# EAGLE design TempHumiditySensorBoard (EAGLE 8.5.0)
MODDATE: 2015-12-09; MODINIT: JQI
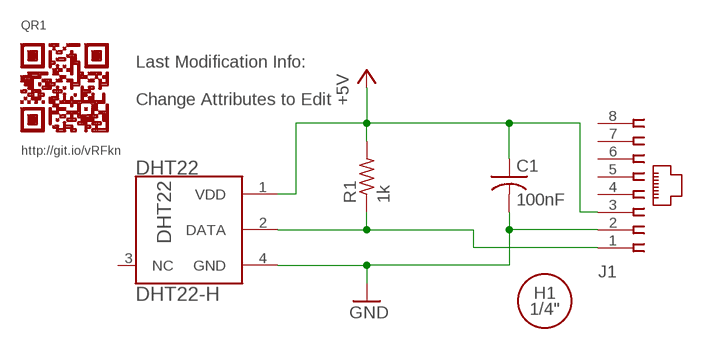
[diagram p0: schematic, sheet 1]

## Parts
C1  100nF  C-USC1206  [C1206]
DHT22  DHT22-H  [DHT22-H]
H1  MOUNT-HOLE-1/4"-FREE  [MOUNT-HOLE-1/4"-FREE]
J1  555164-1  [555164-1]
QR1  QR-HTTP://GIT.IO/VRFKN  [QR-HTTP://GIT.IO/VRFKN]
R1  1k  R-US_R1206  [R1206]
U$2  INFOROW  [INIT_DATE_LINE]

## Nets
+5V: C1.1 DHT22.1(VDD) J1.3 R1.2
DATA: DHT22.2(DATA) J1.1 R1.1
GND: C1.2 DHT22.4(GND) J1.2
Unconnected: DHT22.3(NC) J1.4 J1.5 J1.6 J1.7 J1.8

## Library data of the parts
C1 = resistor:C-US: CAPACITOR, American symbol; PARTNO: CL31B104JBCNNNC
DHT22 = dht22:DHT22; PARTNO: 385
H1 = JQI-holes:MOUNT-HOLE; HOLE-FIT: Free; HOLE-SIZE: 1/4"
J1 = con-amp:555164-1: AMP connector; PARTNO: 555164-1
QR1 = QR-git.io-vRFkn:QR-HTTP://GIT.IO/VRFKN: QR Code pointing to http://git.io/vRFkn; QR_DEST: http://git.io/vRFkn
R1 = resistor:R-US_: RESISTOR, American symbol; PARTNO: ERJ-8ENF2001V
U$2 = info:INFO; MODAUTH: ZSS; MODDATE: 2015-12-09

## Net classes
0 default: width 0.254 mm

## Board
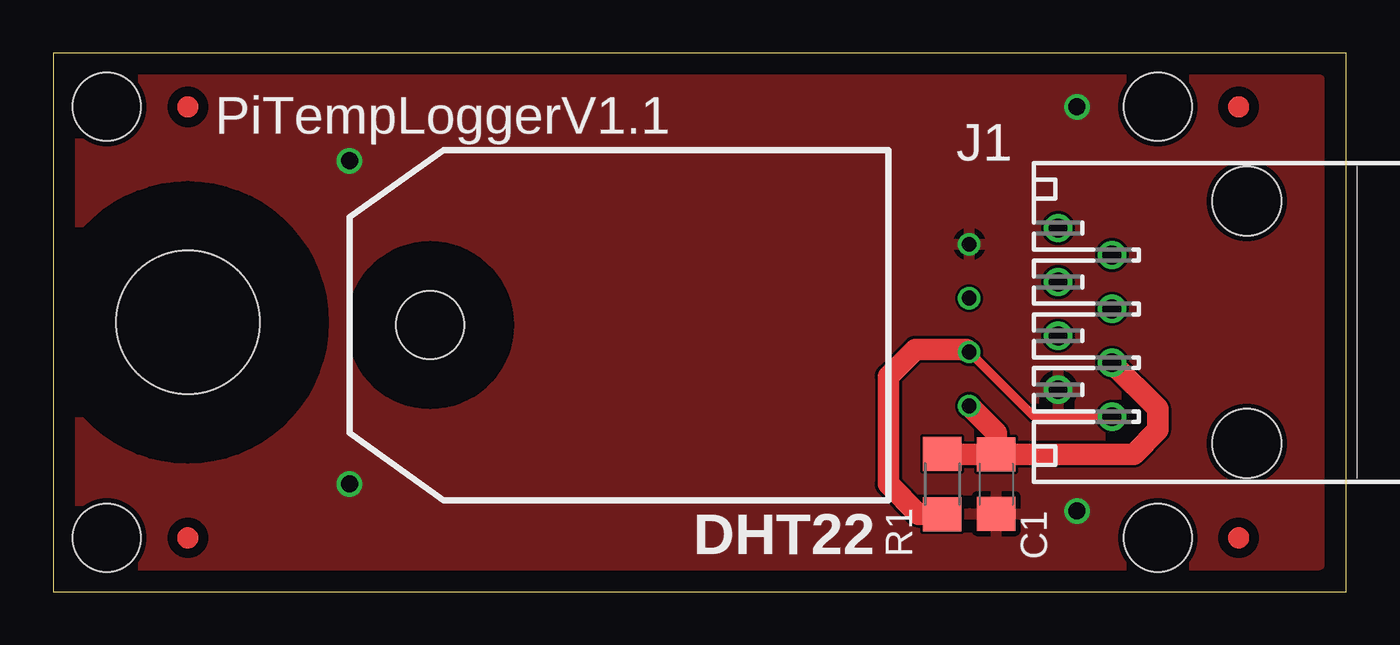
[diagram p1: board, top side]
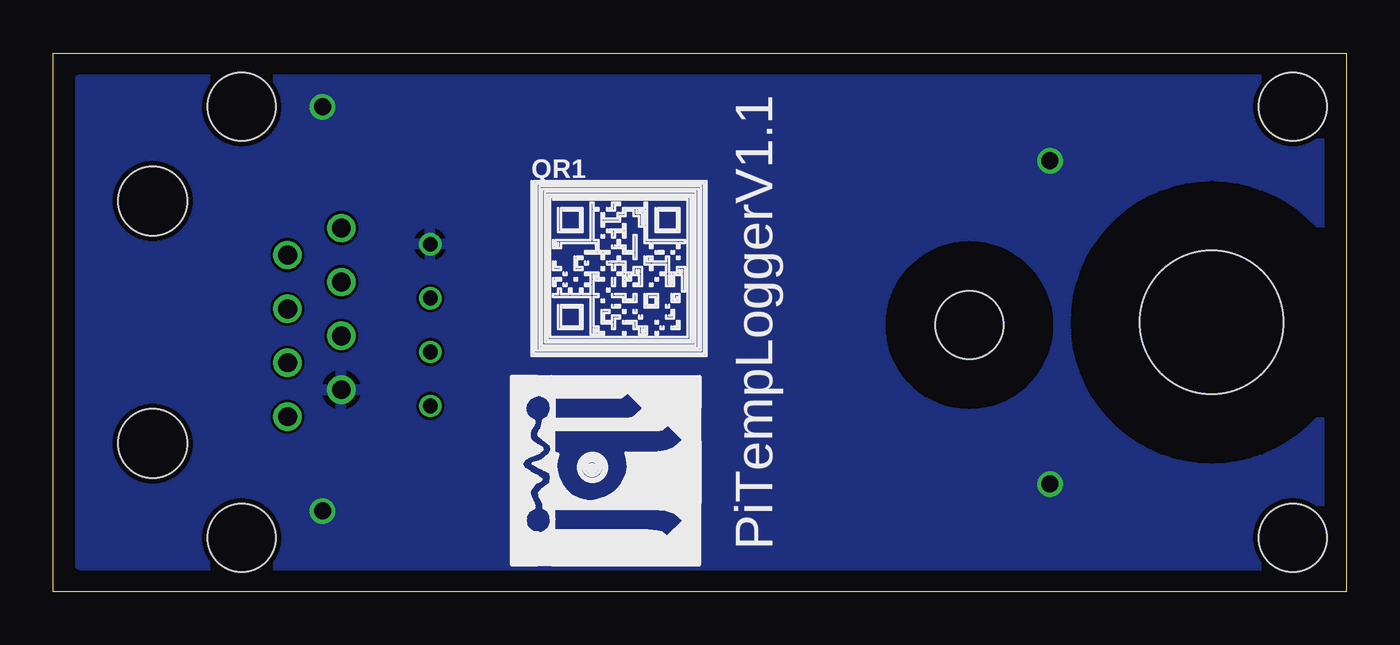
[diagram p2: board, bottom side, seen from below]

Size 60.96 x 25.4 mm. Coordinates in mm from the lower left corner, seen from the top.
Outline: 0,0 60.96,0 60.96,25.4 0,25.4 0,0
Copper layers (1*16): Top 0.035mm / dielectric 1.5mm / Bottom 0.035mm
Design rules "MF_Standard_2_Layer": minimum track width 5mil, minimum drill 12mil, track to track 5mil, track to pad 5mil, pad to pad 5mil, via to via 5mil, smd to smd 0mil, copper to edge 10mil, drill to drill 10mil, minimum pad ring 6mil, minimum via ring 6mil, stop-mask expansion 2mil, vias tented up to drill 25mil, thermal gap 10mil
Holes 3.2 mm at 52.07,2.54 52.07,22.86 2.54,2.54 2.54,22.86

### Footprints (pad centres in the part's own frame; a part is rotated, then mirrored left to right if it is on the bottom)
C1206 = smd 1.6 x 1.8: 1 -1.4,0; 2 1.4,0
DHT22-H = drill 0.7: 1 -3.81,0; 2 -1.27,0; 3 1.27,0; 4 3.81,0 | hole 3.2: 0,25.4
MOUNT-HOLE-1/4"-FREE = hole 6.756: 0,0
555164-1 = drill 0.889: 1 -4.445,5.207; 2 -3.175,7.747; 3 -1.905,5.207; 4 -0.635,7.747; 5 0.635,5.207; 6 1.905,7.747; 7 3.175,5.207; 8 4.445,7.747 | hole 3.251: -5.715,-1.143; 5.715,-1.143
R1206 = smd 1.6 x 1.803: 1 -1.422,0; 2 1.422,0

### Placement (x,y rotation side)
C1  44.45,5.08 270 top
DHT22  43.18,12.57 90 top
H1  6.35,12.7 0 top
J1  55.12,12.7 90 top
QR1  34.29,15.24 0 bottom
R1  41.91,5.08 90 top
U$1  [FID1MM]  6.35,2.54 0 top
U$2  24.13,5.08 90 bottom
U$3  [FID1MM]  6.35,22.86 0 top
U$4  [FID1MM]  55.88,2.54 0 top
U$5  [FID1MM]  55.88,22.86 0 top
U$6  [JQI_LOGO_NEGATIVE-SILKSCREEN]  30.48,1.27 90 bottom

### Tracks (layer width: path | path; a pad name or v marks a point on that pad's centre or on a via)
+5V
  Top 0.406: R1.2 41.93,6.48
  Top 1.016: DHT22.1 44.45,7.49 C1.1 | 41.93,6.48 C1.1 | J1.3 52.07,8.64 52.07,7.62 50.93,6.48 C1.1
DATA
  Top 0.406: 43.05,11.43 DHT22.2 46.23,8.26 J1.1
  Top 1.016: 43.05,11.43 40.64,11.43 39.37,10.16 39.37,5.08 40.79,3.66 R1.1
GND  (via drill 0.8)
  other vias: 48.26,3.81 48.26,22.86 13.97,20.32 13.97,5.08
  pour Top: 1.27,24.13 1.27,1.27 59.69,1.27 59.69,24.13
  pour Bottom: 1.27,24.13 59.69,24.13 59.69,1.27 1.27,1.27

### Text on the board
tNames: PiTempLoggerV1.1
bNames: PiTempLoggerV1.1